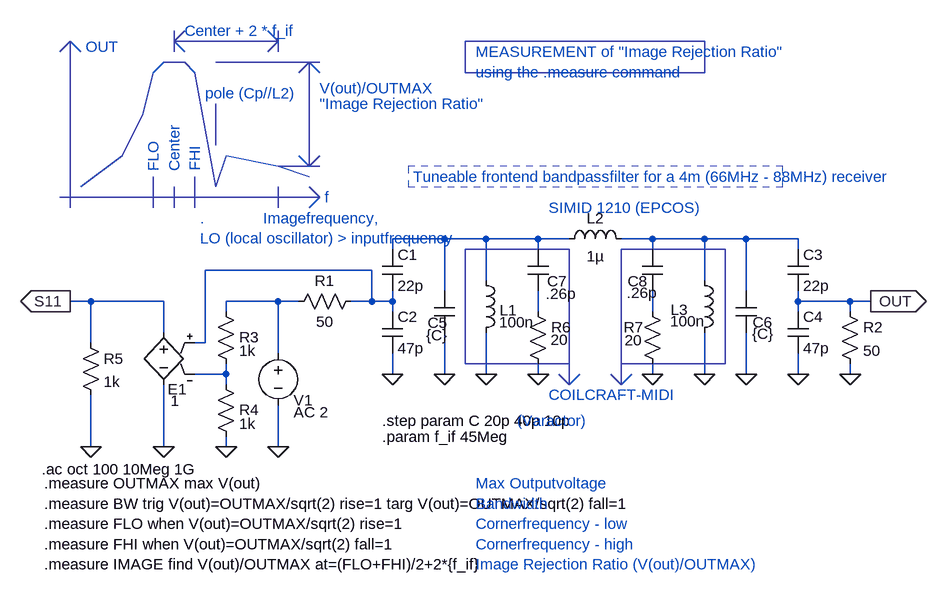
[diagram p0: schematic BP-4m-V1.asc]
BP-4m-V1.asc, the LTspice schematic file:
Version 4
SHEET 1 884 680
WIRE -224 208 -224 128
WIRE -224 128 -192 128
WIRE -112 128 -80 128
WIRE -48 128 -48 112
WIRE -48 128 -48 144
WIRE -48 48 -48 32
WIRE -48 32 32 32
WIRE 96 32 96 96
WIRE 96 32 176 32
WIRE 96 176 96 240
WIRE -48 208 -48 240
WIRE 576 32 576 48
WIRE 432 32 432 96
WIRE 432 32 496 32
WIRE 432 176 432 240
WIRE 576 112 576 128
WIRE 576 208 576 240
WIRE 576 128 656 128
WIRE 576 128 576 144
WIRE 656 128 656 144
WIRE 656 224 656 240
WIRE -224 288 -224 352
WIRE -304 336 -304 352
WIRE -304 256 -304 240
WIRE -304 144 -304 128
WIRE -304 128 -224 128
WIRE -352 240 -304 240
WIRE -304 240 -304 224
WIRE -352 192 -336 192
WIRE -336 192 -336 80
WIRE -336 80 -80 80
WIRE -80 80 -80 128
WIRE -80 128 -48 128
WIRE -400 256 -400 352
WIRE -400 176 -400 128
WIRE 656 128 688 128
WIRE 304 32 352 32
WIRE 32 32 32 112
WIRE 32 32 96 32
WIRE 32 176 32 240
WIRE 496 32 496 112
WIRE 496 32 576 32
WIRE 496 176 496 240
WIRE -400 128 -512 128
WIRE -512 128 -512 192
WIRE -512 272 -512 352
WIRE -512 128 -544 128
WIRE 176 32 176 48
WIRE 176 32 224 32
WIRE 176 112 176 144
WIRE 176 224 176 240
WIRE 352 112 352 144
WIRE 352 224 352 240
WIRE 352 32 352 48
WIRE 352 32 432 32
FLAG -400 352 0
FLAG -304 352 0
FLAG -224 352 0
FLAG -48 240 0
FLAG 96 240 0
FLAG 432 240 0
FLAG 576 240 0
FLAG 656 240 0
FLAG 688 128 OUT
IOPIN 688 128 Out
FLAG 32 240 0
FLAG 496 240 0
FLAG -512 352 0
FLAG -544 128 S11
IOPIN -544 128 Out
FLAG 176 240 0
FLAG 352 240 0
SYMBOL res -208 144 R270
WINDOW 0 32 56 VTop 0
WINDOW 3 0 56 VBottom 0
SYMATTR InstName R1
SYMATTR Value 50
SYMBOL cap -64 48 R0
SYMATTR InstName C1
SYMATTR Value 22p
SYMBOL cap -64 144 R0
SYMATTR InstName C2
SYMATTR Value 47p
SYMBOL ind 80 80 R0
WINDOW 0 37 62 Left 0
SYMATTR InstName L1
SYMATTR Value 100n
SYMATTR SpiceLine Rser=.56
SYMBOL cap 560 48 R0
SYMATTR InstName C3
SYMATTR Value 22p
SYMBOL cap 560 144 R0
SYMATTR InstName C4
SYMATTR Value 47p
SYMBOL res 640 128 R0
SYMATTR InstName R2
SYMATTR Value 50
SYMBOL voltage -224 192 R0
WINDOW 123 24 107 Left 0
WINDOW 39 0 0 Left 0
WINDOW 0 24 88 Left 0
SYMATTR Value2 AC 2
SYMATTR InstName V1
SYMATTR Value ""
SYMBOL e -400 160 M0
WINDOW 0 -35 103 Left 0
WINDOW 3 -24 121 Left 0
SYMATTR InstName E1
SYMATTR Value 1
SYMBOL res -320 128 R0
WINDOW 0 36 55 Left 0
SYMATTR InstName R3
SYMATTR Value 1k
SYMBOL res -320 240 R0
WINDOW 0 36 55 Left 0
SYMATTR InstName R4
SYMATTR Value 1k
SYMBOL ind 208 48 R270
WINDOW 0 32 56 VTop 0
WINDOW 3 5 56 VBottom 0
SYMATTR InstName L2
SYMATTR Value 1µ
SYMATTR SpiceLine Rser=.5 Rpar=7.8k Cpar=.7p
SYMBOL cap 16 112 R0
WINDOW 0 -10 49 Left 0
WINDOW 3 -12 68 Left 0
SYMATTR InstName C5
SYMATTR Value {C}
SYMATTR SpiceLine Rpar=100k
SYMBOL cap 480 112 R0
WINDOW 0 26 48 Left 0
WINDOW 3 25 66 Left 0
SYMATTR InstName C6
SYMATTR Value {C}
SYMATTR SpiceLine Rpar=100k
SYMBOL ind 416 80 R0
WINDOW 0 -36 61 Left 0
WINDOW 3 -37 79 Left 0
SYMATTR InstName L3
SYMATTR Value 100n
SYMATTR SpiceLine Rser=.56
SYMBOL res -528 176 R0
SYMATTR InstName R5
SYMATTR Value 1k
SYMBOL cap 160 48 R0
WINDOW 0 30 49 Left 0
WINDOW 3 28 68 Left 0
SYMATTR InstName C7
SYMATTR Value .26p
SYMBOL res 160 128 R0
WINDOW 3 35 59 Left 0
SYMATTR InstName R6
SYMATTR Value 20
SYMBOL cap 336 48 R0
WINDOW 0 -22 49 Left 0
WINDOW 3 -24 67 Left 0
SYMATTR InstName C8
SYMATTR Value .26p
SYMBOL res 336 128 R0
WINDOW 0 -28 40 Left 0
WINDOW 3 -27 60 Left 0
SYMATTR InstName R7
SYMATTR Value 20
TEXT -588 386 Left 0 !.ac oct 100 10Meg 1G
TEXT -64 312 Left 0 !.step param C 20p 40p 10p
TEXT -584 408 Left 0 !.measure OUTMAX max V(out)\n.measure BW trig V(out)=OUTMAX/sqrt(2) rise=1 targ V(out)=OUTMAX/sqrt(2) fall=1\n.measure FLO when V(out)=OUTMAX/sqrt(2) rise=1\n.measure FHI when V(out)=OUTMAX/sqrt(2) fall=1\n.measure IMAGE find V(out)/OUTMAX at=(FLO+FHI)/2+2*{f_if}
TEXT -16 -64 Left 0 ;Tuneable frontend bandpassfilter for a 4m (66MHz - 88MHz) receiver
TEXT 192 272 Left 0 ;COILCRAFT-MIDI
TEXT 192 -16 Left 0 ;SIMID 1210 (EPCOS)
TEXT 144 312 Left 0 ;(Varactor)
TEXT -64 336 Left 0 !.param f_if 45Meg
TEXT 80 408 Left 0 ;Max Outputvoltage\nBandwidth\nCornerfrequency - low\nCornerfrequency - high\nImage Rejection Ratio (V(out)/OUTMAX)
TEXT -520 -264 Left 0 ;OUT
TEXT -152 -32 Left 0 ;f
TEXT -416 -72 VLeft 0 ;FLO
TEXT -352 -72 VLeft 0 ;FHI
TEXT -384 -72 VLeft 0 ;Center
TEXT -160 -200 Left 0 ;V(out)/OUTMAX
TEXT -368 -288 Left 0 ;Center + 2 * f_if
TEXT -160 -176 Left 0 ;"Image Rejection Ratio"
TEXT -344 0 Left 0 ;.             Imagefrequency,\nLO (local oscillator) > inputfrequency
TEXT -336 -192 Left 0 ;pole (Cp//L2)
TEXT 80 -256 Left 0 ;MEASUREMENT of "Image Rejection Ratio"\nusing the .measure command
LINE Normal 224 256 224 224
LINE Normal 304 256 304 224
LINE Normal 224 256 208 240
LINE Normal 240 240 224 256
LINE Normal 304 256 288 240
LINE Normal 320 240 304 256
LINE Normal -544 -16 -544 -272
LINE Normal -160 -32 -560 -32
LINE Normal -176 -48 -160 -32
LINE Normal -176 -16 -160 -32
LINE Normal -544 -272 -560 -256
LINE Normal -528 -256 -544 -272
LINE Normal -368 -240 -400 -240
LINE Normal -304 -96 -320 -48
LINE Normal -352 -224 -368 -240
LINE Normal -320 -48 -352 -224
LINE Normal -416 -224 -400 -240
LINE Normal -432 -160 -416 -224
LINE Normal -464 -96 -432 -160
LINE Normal -528 -48 -464 -96
LINE Normal -224 -80 -304 -96
LINE Normal -176 -64 -224 -80
LINE Normal -160 -240 -320 -240
LINE Normal -176 -80 -176 -240
LINE Normal -192 -96 -176 -80
LINE Normal -160 -96 -176 -80
LINE Normal -176 -240 -192 -224
LINE Normal -160 -224 -176 -240
LINE Normal -384 -256 -384 -288
LINE Normal -224 -256 -224 -288
LINE Normal -224 -272 -384 -272
LINE Normal -384 -272 -368 -288
LINE Normal -368 -256 -384 -272
LINE Normal -224 -272 -240 -288
LINE Normal -240 -256 -224 -272
LINE Normal -320 -112 -320 -176
LINE Normal -160 -80 -224 -80
LINE Normal -416 -16 -416 -64
LINE Normal -384 -16 -384 -48
LINE Normal -352 -16 -352 -64
LINE Normal -224 -16 -224 -48
RECTANGLE Normal 552 -80 -24 -48 1
RECTANGLE Normal 224 224 64 48
RECTANGLE Normal 464 224 304 48
RECTANGLE Normal 432 -272 64 -224

The netlist it stands for:
* BP-4m-V1.asc
R1 N001 N002 50
C1 N003 N002 22p
C2 N002 0 47p
L1 N003 0 100n Rser=.56
C3 N004 OUT 22p
C4 OUT 0 47p
R2 OUT 0 50
V1 N001 0 AC 2
E1 S11 0 N002 N005 1
R3 N001 N005 1k
R4 N005 0 1k
L2 N003 N004 1µ Rser=.5 Rpar=7.8k Cpar=.7p
C5 N003 0 {C} Rpar=100k
C6 N004 0 {C} Rpar=100k
L3 N004 0 100n Rser=.56
R5 S11 0 1k
C7 N003 N006 .26p
R6 N006 0 20
C8 N004 N007 .26p
R7 N007 0 20
.ac oct 100 10Meg 1G
.step param C 20p 40p 10p
.measure OUTMAX max V(out)
.measure BW trig V(out)=OUTMAX/sqrt(2) rise=1 targ V(out)=OUTMAX/sqrt(2) fall=1
.measure FLO when V(out)=OUTMAX/sqrt(2) rise=1
.measure FHI when V(out)=OUTMAX/sqrt(2) fall=1
.measure IMAGE find V(out)/OUTMAX at=(FLO+FHI)/2+2*{f_if}
* Tuneable frontend bandpassfilter for a 4m (66MHz - 88MHz) receiver
* COILCRAFT-MIDI
* SIMID 1210 (EPCOS)
* (Varactor)
.param f_if 45Meg
* Max Outputvoltage
* Bandwidth
* Cornerfrequency - low
* Cornerfrequency - high
* Image Rejection Ratio (V(out)/OUTMAX)
* OUT
* f
* FLO
* FHI
* Center
* V(out)/OUTMAX
* Center + 2 * f_if
* "Image Rejection Ratio"
* .             Imagefrequency,
* LO (local oscillator) > inputfrequency
* pole (Cp//L2)
* MEASUREMENT of "Image Rejection Ratio"
* using the .measure command
.backanno
.end